# EAGLE schematic YOTSUBA_+X_EM_ver.3.2 (EAGLE 9.6.2)
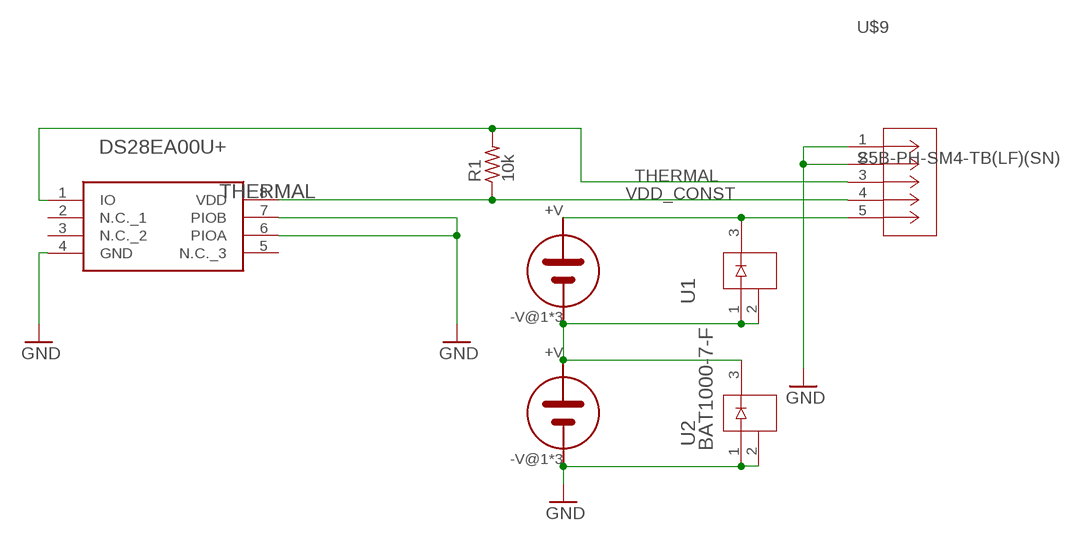
[diagram p0: schematic, sheet 1]

## Parts
R1  10k  R-US_R0805  [R0805]
THERMAL  DS28EA00U+  [SOP65P490X110-8N]
U1  BAT1000-7-F  [SOT23_BAT_DIO]
U2  BAT1000-7-F  [SOT23_BAT_DIO]
U$2  3G30A  [SOLAR_3G30A]
U$3  3G30A  [SOLAR_3G30A]
U$9  S5B-PH-SM4-TB(LF)(SN)  [CONN_S5B-PH-SM4-TB_JST]

## Nets
GND [GND]: THERMAL.4(GND) THERMAL.6(PIOA) THERMAL.7(PIOB) U2.1 U2.2 U$3.-V@1(-V) U$3.-V@2(-V) U$3.-V@3(-V) U$9.1 U$9.2
N$5: U1.1 U1.2 U2.3 U$2.-V@1(-V) U$2.-V@2(-V) U$2.-V@3(-V) U$3.+V
N$6: U1.3 U$2.+V U$9.5
THERMAL: R1.2 THERMAL.1(IO) U$9.3
VDD_CONST: R1.1 THERMAL.8(VDD) U$9.4
Unconnected: THERMAL.2(N.C._1) THERMAL.3(N.C._2) THERMAL.5(N.C._3)

## Library data of the parts
R1 = rcl:R-US_: RESISTOR, American symbol; SPICEPREFIX: R
THERMAL = DS28EA00U+:DS28EA00U+: Maxim DS28EA00U+ Temperature Sensor 8-Pin uMAX, -40 +85 C Source: Datasheet <https://datasheets.maximintegrated.com/en/ds/DS28EA00.pdf>; ARROW_PART_NUMBER: DS28EA00U+; ARROW_PRICE-STOCK: https://www.arrow.com/en/products/ds28ea00u/maxim-integrated?region=nac; DESCRIPTION: Maxim DS28EA00U+ Temperature Sensor 8-Pin uMAX, -40 +85 C; HEIGHT: 1.1mm; MANUFACTURER_NAME: Analog Devices; MANUFACTURER_PART_NUMBER: DS28EA00U+; MOUSER_PART_NUMBER: 700-DS28EA00U; MOUSER_PRICE-STOCK: https://www.mouser.co.uk/ProductDetail/Maxim-Integrated/DS28EA00U%2b?qs=7H2Jq%252ByxpJJHHt%2F9DIHuNA%3D%3D
U1 U2 = BAT1000:BAT1000-7-F; COPYRIGHT: Copyright (C) 2023 Ultra Librarian. All rights reserved.; DIGIKEY_PART_NUMBER_1: BAT1000-7FDITR-ND; DIGIKEY_PART_NUMBER_2: BAT1000-7FDICT-ND; DIGIKEY_PART_NUMBER_3: BAT1000-7FDIDKR-ND; MANUFACTURER_PART_NUMBER: BAT1000-7-F; MFR_NAME: Diodes Inc
U$2 U$3 = 3G30A_normal:3G30A
U$9 = S5B-PH-SM4:S5B-PH-SM4-TB(LF)(SN); COPYRIGHT: Copyright (C) 2023 Ultra Librarian. All rights reserved.; DIGIKEY_PART_NUMBER_1: 455-1752-2-ND; DIGIKEY_PART_NUMBER_2: 455-1752-1-ND; DIGIKEY_PART_NUMBER_3: 455-1752-6-ND; MANUFACTURER_PART_NUMBER: S5B-PH-SM4-TB(LF)(SN); MFR_NAME: JST

## Net classes
0 default: clearance 0.02 mm
2 GND: clearance 0.5 mm to class 0, clearance 0.5 mm to class 1, clearance 0.5 mm